# EAGLE design goodthopter10 (EAGLE 6.2)
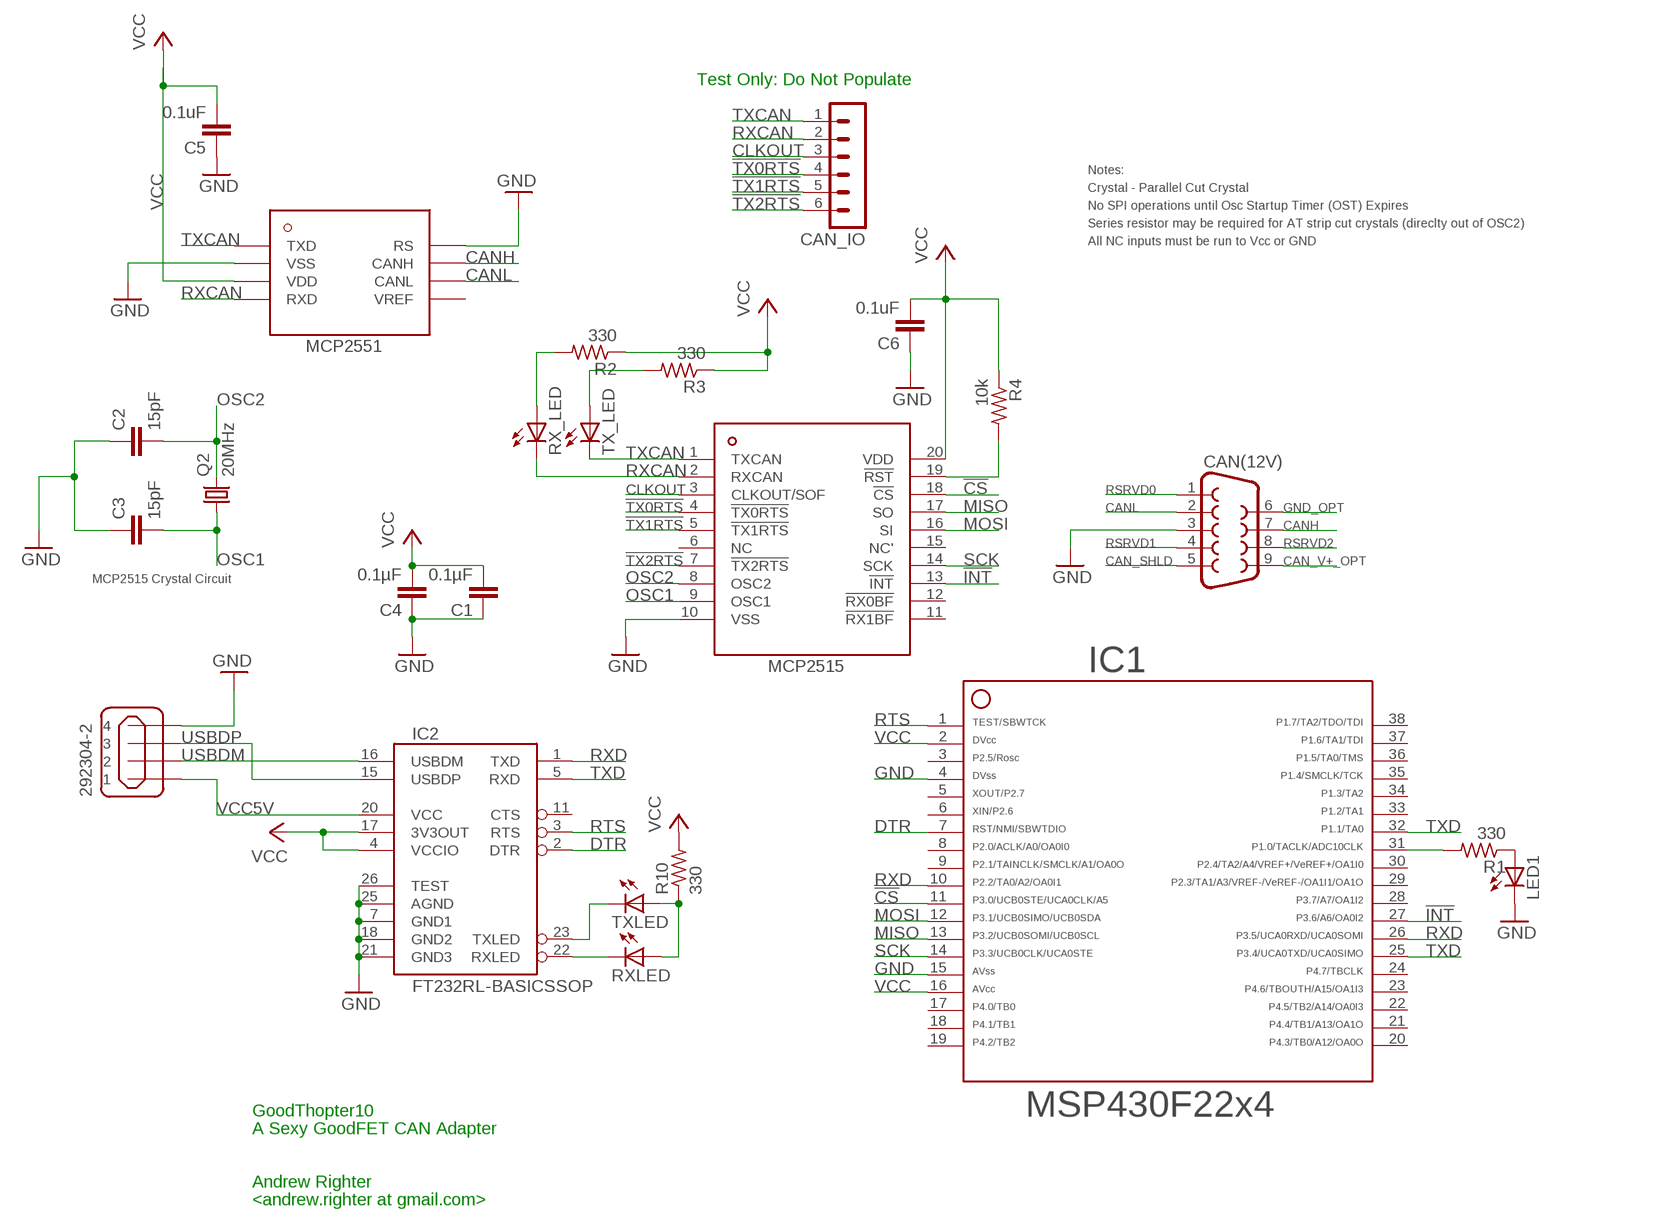
[diagram p0: schematic, sheet 1]

## Parts
292304-2  MINI-USB_4P-292304-2  [85-32004-10X]
C1  0.1µF  C-EUC0603  [C0603]
C2  15pF  C-EUC0603  [C0603]
C3  15pF  C-EUC0603  [C0603]
C4  0.1µF  C-EUC0603  [C0603]
C5  0.1uF  C-EUC0603  [C0603]
C6  0.1uF  C-EUC0603  [C0603]
CAN(12V)  DB9MALE  [DB9_MALE]
CAN_IO  MA06-1  [MA06-1]
IC1  F22X4---DA38  [DA38]
IC2  FT232RL-BASICSSOP  [SSOP28DB]
LED1  LEDCHIP-LED0603  [CHIP-LED0603]
Q2  20MHz  CRYSTALHC49UP  [HC49UP]
R1  330  R-US_R0603  [R0603]
R2  330  R-US_R0603  [R0603]
R3  330  R-US_R0603  [R0603]
R4  10k  R-US_R0603  [R0603]
R10  330  R-US_R0603  [R0603]
RX_LED  LEDCHIP-LED0603  [CHIP-LED0603]
RXLED  LEDCHIP-LED0603  [CHIP-LED0603]
TX_LED  LEDCHIP-LED0603  [CHIP-LED0603]
TXLED  LEDCHIP-LED0603  [CHIP-LED0603]
U$1  MCP2515  [TSSOP20]
U$2  MCP2551  [SOIC-8]

## Nets
!CS: IC1.11 U$1.18(!CS)
!INT: IC1.27 U$1.13(!INT)
!TX0RTS: CAN_IO.4 U$1.4(!TX0RTS)
!TX1RTS: CAN_IO.5 U$1.5(!TX1RTS)
!TX2RTS: CAN_IO.6 U$1.7(!TX2RTS)
CAN_SHLD: CAN(12V).5
CAN_V+_OPT: CAN(12V).9
CANH: CAN(12V).7 U$2.CANH
CANL: CAN(12V).2 U$2.CANL
CLKOUT: CAN_IO.3 U$1.3(CLKOUT/SOF)
DTR: IC1.7 IC2.2(DTR)
GND: 292304-2.4 C1.1 C2.1 C3.1 C4.1 C5.1 C6.1 CAN(12V).3 IC1.4 IC1.15 IC2.7(GND1) IC2.18(GND2) IC2.21(GND3) IC2.25(AGND) IC2.26(TEST) LED1.C U$1.10(VSS) U$2.RS U$2.VSS
GND_OPT: CAN(12V).6
MISO: IC1.13 U$1.17(SO)
MOSI: IC1.12 U$1.16(SI)
N$1: R2.2 RX_LED.A
N$2: R3.2 TX_LED.A
N$5: R4.2 U$1.19(!RST)
N$6: IC2.22(RXLED) RXLED.C
N$7: IC2.23(TXLED) TXLED.C
N$8: R10.1 RXLED.A TXLED.A
N$9: IC1.31 R1.2
N$10: LED1.A R1.1
OSC1: C3.2 Q2.1 U$1.9(OSC1)
OSC2: C2.2 Q2.2 U$1.8(OSC2)
RSRVD0: CAN(12V).1
RSRVD1: CAN(12V).4
RSRVD2: CAN(12V).8
RTS: IC1.1 IC2.3(RTS)
RXCAN: CAN_IO.2 RX_LED.C U$1.2(RXCAN) U$2.RXD
RXD: IC1.10 IC1.26 IC2.1(TXD)
SCK: IC1.14 U$1.14(SCK)
TXCAN: CAN_IO.1 TX_LED.C U$1.1(TXCAN) U$2.TXD
TXD: IC1.25 IC1.32 IC2.5(RXD)
USBDM: 292304-2.2 IC2.16(USBDM)
USBDP: 292304-2.3 IC2.15(USBDP)
VCC: C1.2 C4.2 C5.2 C6.2 IC1.2 IC1.16 IC2.4(VCCIO) IC2.17(3V3OUT) R2.1 R3.1 R4.1 R10.2 U$1.20(VDD) U$2.VDD
VCC5V: 292304-2.1 IC2.20(VCC)
Unconnected: IC1.3 IC1.5 IC1.6 IC1.8 IC1.9 IC1.17 IC1.18 IC1.19 IC1.20 IC1.21 IC1.22 IC1.23 IC1.24 IC1.28 IC1.29 IC1.30 IC1.33 IC1.34 IC1.35 IC1.36 IC1.37 IC1.38 IC2.11(CTS) U$1.6(NC) U$1.11(!RX1BF) U$1.12(!RX0BF) U$1.15(NC') U$2.VREF

## Notes on the sheet
- Test Only: Do Not Populate
- Notes:
- Crystal - Parallel Cut Crystal
- No SPI operations until Osc Startup Timer (OST) Expires
- Series resistor may be required for AT strip cut crystals (direclty out of OSC2)
- All NC inputs must be run to Vcc or GND
- MCP2515 Crystal Circuit
- 292304-2
- GoodThopter10
- A Sexy GoodFET CAN Adapter
- Andrew Righter
- <andrew.righter at gmail.com>

## Library data of the parts
292304-2 = USB-TYPE-B:MINI-USB_4P-: MINI USB 4 Pol. Source: www.cypressindustries.com; OC_FARNELL: unknown; OC_NEWARK: unknown
C1-C6 = rcl:C-EU: CAPACITOR, European symbol
CAN(12V) = SparkFun-Connectors:DB9: DB9 Connector Standard DB9 (D-Sub 9) serial connector. Can be used for CAN bus as well as RS485 and RS232. Footprint production proven. Spark Fun Electronics SKU : PRT-00429
CAN_IO = con-lstb:MA06-1: PIN HEADER; OC_FARNELL: unknown; OC_NEWARK: unknown
IC1 = TI_MSP430_v13:F22X4---DA38: ***MSP430F22x4***DA38
IC2 = SparkFun:FT232RL-BASIC: USB UART This is the simplified version of the FT232RL unit. Only what you need, nothing you don't. Spark Fun Electronics SKU : COM-00650
LED1 RX_LED RXLED TX_LED TXLED = led:LED: LED OSRAM: - CHIPLED LG R971, LG N971, LY N971, LG Q971, LY Q971, LO R971, LY R971 LH N974, LH R974 LS Q976, LO Q976, LY Q976 LO Q996 - Hyper CHIPLED LW Q18S LB Q993, LB Q99A, LB R99A - SideLED LS A670, LO A670, LY A670, LG A670, LP A670 LB A673, LV A673, LT A673, LW A673 LH A674 LY A675 LS A676, LA A676, LO A676, LY A676, LW A676 LS A679, LY A679, LG A679 - Hyper Micro SIDELED® LS Y876, LA Y876, LO Y876, LY Y876 LT Y87S - SmartLED LW L88C, LW L88S LB L89C, LB L89S, LG L890 LS L89K, LO L89K, LY L89K LS L896, LA L896, LO L896, LY L896 - TOPLED LS T670, LO T670, LY T670, LG T670, LP T670 LSG T670, LSP T670, LSY T670, LOP T670, LYG T670 LG T671, LOG T671, LSG T671 LB T673, LV T673, LT T673, LW T673 LH T674 LS T676, LA T676, LO T676, LY T676, LB T676, LH T676, LSB T676, LW T676 LB T67C, LV T67C, LT T67C, LS T67K, LO T67K, LY T67K, LW E67C LS E67B, LA E67B, LO E67B, LY E67B, LB E67C, LV E67C, LT E67C LW T67C LS T679, LY T679, LG T679 LS T770, LO T770, LY T770, LG T770, LP T770 LB T773, LV T773, LT T773, LW T773 LH T774 LS E675, LA E675, LY E675, LS T675 LS T776, LA T776, LO T776, LY T776, LB T776 LHGB T686 LT T68C, LB T68C - Hyper Mini TOPLED® LB M676 - Mini TOPLED Santana® LG M470 LS M47K, LO M47K, LY M47K Source: http://www.osram.convergy.de LUXEON: - LUMILED® LXK2-PW12-R00, LXK2-PW12-S00, LXK2-PW14-U00, LXK2-PW14-V00 LXK2-PM12-R00, LXK2-PM12-S00, LXK2-PM14-U00 LXK2-PE12-Q00, LXK2-PE12-R00, LXK2-PE12-S00, LXK2-PE14-T00, LXK2-PE14-U00 LXK2-PB12-K00, LXK2-PB12-L00, LXK2-PB12-M00, LXK2-PB14-N00, LXK2-PB14-P00, LXK2-PB14-Q00 LXK2-PR12-L00, LXK2-PR12-M00, LXK2-PR14-Q00, LXK2-PR14-R00 LXK2-PD12-Q00, LXK2-PD12-R00, LXK2-PD12-S00 LXK2-PH12-R00, LXK2-PH12-S00 LXK2-PL12-P00, LXK2-PL12-Q00, LXK2-PL12-R00 Source: www.luxeon.com KINGBRIGHT: KA-3528ASYC Source: www.kingbright.com
Q2 = crystal:CRYSTAL: CRYSTAL; OC_FARNELL: unknown; OC_NEWARK: unknown
R1-R4 R10 = rcl:R-US_: RESISTOR, American symbol
U$1 = MCP2515:MCP2515: Microchip Technology’s MCP2515 is a stand-alone Controller Area Network (CAN) controller that implements the CAN specification, version 2.0B. It is capable of transmitting and receiving both standard and extended data and remote frames. The MCP2515 has two acceptance masks and six acceptance filters that are used to filter out unwanted messages, thereby reducing the host MCUs overhead. The MCP2515 interfaces with microcontrollers (MCUs) via an industry standard Serial Peripheral Interface (SPI).
U$2 = MCP2551:MCP2551: The MCP2551 is a high-speed CAN, fault-tolerant device that serves as the interface between a CAN protocol controller and the physical bus. The MCP2551 provides differential transmit and receive capability for the CAN protocol controller and is fully compatible with the ISO-11898 standard, including 24V requirements. It will operate at speeds of up to 1 Mb/s. Typically, each node in a CAN system must have a device to convert the digital signals generated by a CAN controller to signals suitable for transmission over the bus cabling (differential output). It also provides a buffer between the CAN controller and the high-voltage spikes that can be generated on the CAN bus by outside sources (EMI, ESD, electrical transients, etc.).

## Board
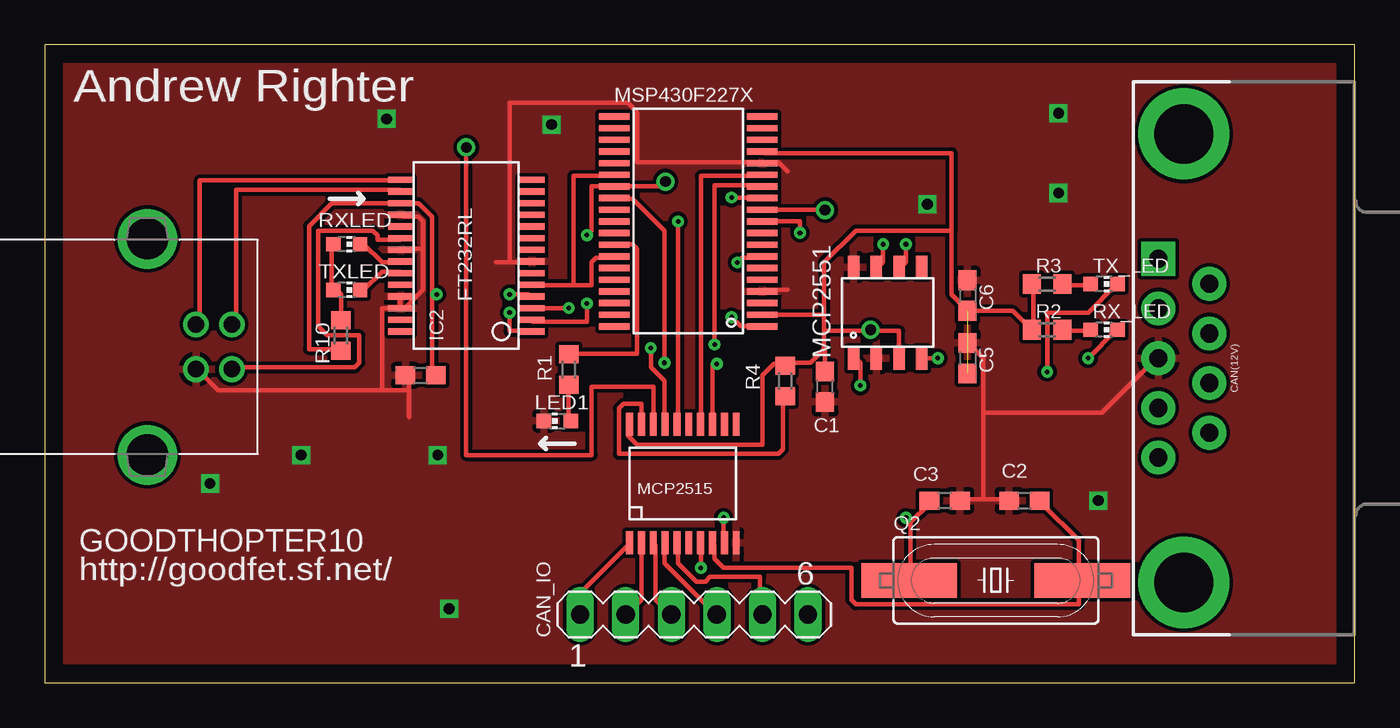
[diagram p1: board, top side]
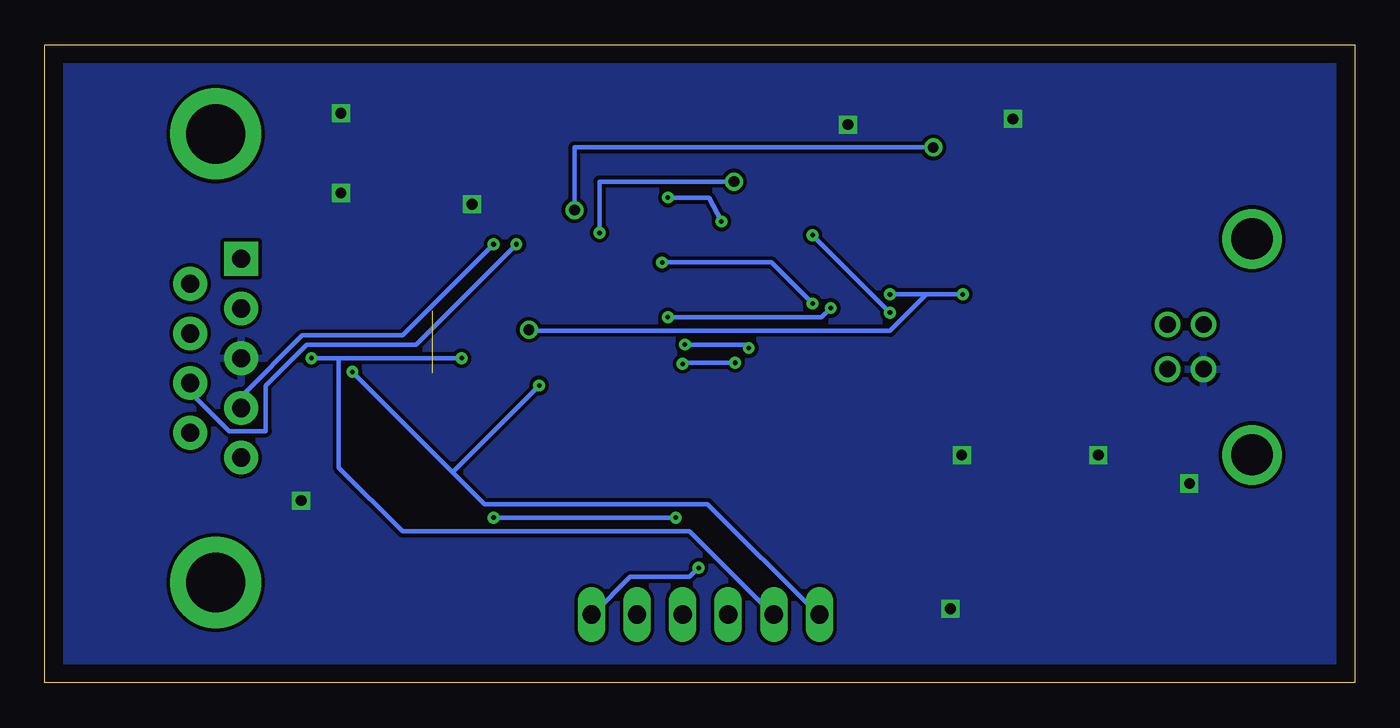
[diagram p2: board, bottom side, seen from below]

Size 73.03 x 35.56 mm. Coordinates in mm from the lower left corner, seen from the top.
Outline: 0,0 73.03,0 73.03,35.56 0,35.56 0,0
Copper layers (1*16): Top 0.035mm / dielectric 1.5mm / Bottom 0.035mm
Design rules: minimum track width 10mil, minimum drill 10mil, track to track 8mil, track to pad 8mil, pad to pad 8mil, via to via 8mil, smd to smd 8mil, copper to edge 40mil, drill to drill 10mil, minimum pad ring 10mil, minimum via ring 8mil, stop-mask expansion 4mil, vias tented up to drill 0mil, thermal gap 10mil

### Footprints (pad centres in the part's own frame; a part is rotated, then mirrored left to right if it is on the bottom)
85-32004-10X = drill 0.92 pad 1.27: 1 4.71,-1.25; 2 4.71,1.25; 3 2.71,1.25; 4 2.71,-1.25 | drill 2.3 pad 3: M1 0,6.02; M2 0,-6.02
C0603 = smd 1.1 x 1: 1 -0.85,0; 2 0.85,0
DB9_MALE = drill 1.016 pad 1.88: 1 5.54,-1.42; 2 2.77,-1.42; 3 0,-1.42; 4 -2.77,-1.42; 6 4.15,1.42; 7 1.38,1.42; 8 -1.38,1.42; 9 -4.15,1.42 | drill 1.016 pad 1.88 square: 5 -5.54,-1.42 | drill 3.302 pad 5.08: G1 -12.5,0; G2 12.5,0
MA06-1 = drill 1.016 long: 1 -6.35,0; 2 -3.81,0; 3 -1.27,0; 4 1.27,0; 5 3.81,0; 6 6.35,0
DA38 = smd 0.35 x 1.705: 1 -5.85,-4.12; 2 -5.2,-4.12; 3 -4.55,-4.12; 4 -3.9,-4.12; 5 -3.25,-4.12; 6 -2.6,-4.12; 7 -1.95,-4.12; 8 -1.3,-4.12; 9 -0.65,-4.12; 10 0,-4.12; 11 0.65,-4.12; 12 1.3,-4.12; 13 1.95,-4.12; 14 2.6,-4.12; 15 3.25,-4.12; 16 3.9,-4.12; 17 4.55,-4.12; 18 5.2,-4.12; 19 5.85,-4.12; 20 5.85,4.12; 21 5.2,4.12; 22 4.55,4.12; 23 3.9,4.12; 24 3.25,4.12; 25 2.6,4.12; 26 1.95,4.12; 27 1.3,4.12; 28 0.65,4.12; 29 0,4.12; 30 -0.65,4.12; 31 -1.3,4.12; 32 -1.95,4.12; 33 -2.6,4.12; 34 -3.25,4.12; 35 -3.9,4.12; 36 -4.55,4.12; 37 -5.2,4.12; 38 -5.85,4.12
SSOP28DB = smd 0.348 x 1.397: 1 -4.225,-3.656; 2 -3.575,-3.656; 3 -2.925,-3.656; 4 -2.275,-3.656; 5 -1.625,-3.656; 6 -0.975,-3.656; 7 -0.325,-3.656; 8 0.325,-3.656; 9 0.975,-3.656; 10 1.625,-3.656; 11 2.275,-3.656; 12 2.925,-3.656; 13 3.575,-3.656; 14 4.225,-3.656; 15 4.225,3.656; 16 3.575,3.656; 17 2.925,3.656; 18 2.275,3.656; 19 1.625,3.656; 20 0.975,3.656; 21 0.325,3.656; 22 -0.325,3.656; 23 -0.975,3.656; 24 -1.625,3.656; 25 -2.275,3.656; 26 -2.925,3.656; 27 -3.575,3.656; 28 -4.225,3.656
CHIP-LED0603 = smd 0.8 x 0.8: A 0,-0.75; C 0,0.75
HC49UP = smd 5.334 x 1.93: 1 -4.826,0; 2 4.826,0
R0603 = smd 1 x 1.1: 1 -0.85,0; 2 0.85,0
TSSOP20 = smd 1.27 x 0.381: 1 -3.302,2.642; 2 -3.302,1.981; 3 -3.302,1.321; 4 -3.302,0.66; 5 -3.302,0; 6 -3.302,-0.66; 7 -3.302,-1.321; 8 -3.302,-1.981; 9 -3.302,-2.642; 10 -3.302,-3.302; 11 3.302,-3.302; 12 3.302,-2.642; 13 3.302,-1.981; 14 3.302,-1.321; 15 3.302,-0.66; 16 3.302,0; 17 3.302,0.66; 18 3.302,1.321; 19 3.302,1.981; 20 3.302,2.642
SOIC-8 = smd 1.27 x 0.635: CANH 2.54,0.635; CANL 2.54,-0.635; RS 2.54,1.905; RXD -2.54,-1.905; TXD -2.54,1.905; VDD -2.54,-0.635; VREF 2.54,-1.905; VSS -2.54,0.635

### Placement (x,y rotation side)
292304-2  5.71,18.73 0 top
C1  43.5,16.51 90 top
C2  54.61,10.16 0 top
C3  50.16,10.16 180 top
C4  20.95,17.14 0 top
C5  51.44,18.1 270 top
C6  51.44,21.59 270 top
CAN(12V)  63.5,18.1 270 top
CAN_IO  36.2,3.81 0 top
IC1  35.88,25.72 90 top
IC2  23.5,23.81 90 top
LED1  28.57,14.61 90 top
Q2  53.02,5.71 0 top
R1  29.21,17.46 90 top
R2  55.88,19.68 0 top
R3  55.88,22.23 0 top
R4  41.27,16.83 270 top
R10  16.51,19.37 270 top
RX_LED  59.05,19.68 270 top
RXLED  16.83,24.45 270 top
TX_LED  59.05,22.23 270 top
TXLED  16.83,21.91 270 top
U$1  35.24,11.11 90 top
U$2  46.99,20.64 90 top

### Tracks (layer width: path | path; a pad name or v marks a point on that pad's centre or on a via)
!CS  (via drill 0.6)
  Top 0.254: IC1.11 43.48,26.37 v43.5,26.35 | v23.5,29.84 23.5,12.7 30.48,12.7 30.48,16.51 33.92,16.51 U$1.18
  Bottom 0.254: v43.5,26.35 43.5,29.84 v23.5,29.84
!INT  (via drill 0.25)
  Top 0.254: v34.54,17.84 34.54,25.21 32.77,26.99 32,26.99 IC1.27 | U$1.13 37.22,17.78 v37.47,17.78
  Bottom 0.254: v37.47,17.78 37.47,17.84 v34.54,17.84
!TX0RTS
  Top 0.254: U$1.4 34.54,7.68 34.54,6.67 37.34,3.87 CAN_IO.4
!TX1RTS
  Top 0.254: U$1.5 35.31,7.68 35.31,6.67 36.32,5.65 36.83,5.65 37.08,5.91 39.88,5.91 39.88,3.87 CAN_IO.5
!TX2RTS  (via drill 0.25)
  Top 0.254: v36.58,6.41 36.58,7.68 U$1.7
  Bottom 0.254: v36.58,6.41 37.08,5.91 40.39,5.91 42.42,3.87 CAN_IO.6
CANH  (via drill 0.25)
  Top 0.254: v46.74,24.45 46.74,23.43 46.48,23.18 U$2.CANH
  Bottom 0.254: v46.74,24.45 52.32,18.86 58.42,18.86 60.71,16.57 60.71,14.03 62.74,14.03 64.77,16.07 64.77,16.57 CAN(12V).7
CANL  (via drill 0.25)
  Top 0.254: v48.01,24.45 48.01,23.43 47.75,23.18 U$2.CANL
  Bottom 0.254: v48.01,24.45 53.09,19.37 58.67,19.37 61.98,16.07 61.98,15.56 CAN(12V).2
CLKOUT
  Top 0.254: U$1.3 34.04,7.68 34.04,4.64 34.8,3.87 CAN_IO.3
DTR  (via drill 0.25)
  Top 0.254: v30.23,21.14 30.23,20.13 27.18,20.13 IC2.2 | v38.61,23.43 38.86,23.69 39.88,23.69 IC1.7
  Bottom 0.254: v30.23,21.14 32.51,23.43 v38.61,23.43
GND  (via drill 0.6)
  Top 0.254: 52.32,10.22 53.59,10.22 C2.1 | 52.32,10.22 51.05,10.22 C3.1 | 52.32,10.22 52.32,15.05 | 52.32,15.05 52.32,18.1 51.56,18.86 C5.1 | 52.32,15.05 58.93,15.05 61.98,18.1 CAN(12V).3 | 41.4,21.91 40.13,21.91 IC1.4 | 41.4,28.51 40.89,29.02 40.13,29.02 IC1.15 39.88,29.02 33.02,29.02 33.02,31.81 32.51,32.32 25.91,32.32 25.91,23.43 | 19.81,20.89 19.81,21.4 IC2.25 | 21.08,24.19 20.07,24.19 IC2.21 | 21.08,24.19 21.08,21.91 20.07,20.89 IC2.26 19.81,20.89 | 21.08,24.19 21.08,25.72 20.83,25.97 20.07,25.97 IC2.18 | 20.32,16.32 20.32,17.08 C4.1 | 20.32,16.32 20.32,14.8 | 27.69,14.8 LED1.C | 25.15,23.43 25.91,23.43 | 25.91,23.43 26.92,23.43 IC2.7 | 20.32,16.32 18.8,16.32 | 18.8,16.32 9.65,16.32 8.64,17.34 292304-2.4 | 19.81,20.89 18.8,20.89 18.8,16.32
  other vias: 28.26,31.11 19.05,31.43 9.21,11.11 14.29,12.7 21.91,12.7 22.54,4.13 49.21,26.67 56.52,27.3 56.52,31.75 58.74,10.16
  pour Top: 0,35.56 73.03,35.56 73.03,0 0,0
  pour Bottom: 0,35.56 73.03,35.56 73.03,0 0,0
MISO  (via drill 0.25)
  Top 0.254: v33.78,18.67 33.78,17.59 34.54,16.83 34.54,14.54 U$1.17 | IC1.13 39.88,27.75 37.34,27.75 v37.34,18.86
  Bottom 0.254: v37.34,18.86 33.78,18.86 v33.78,18.67
MOSI  (via drill 0.25)
  Top 0.254: v35.31,25.72 35.31,14.54 U$1.16 | IC1.12 39.88,26.99 39.88,27.05 v38.29,27.05
  Bottom 0.254: v35.31,25.72 36.01,27.05 v38.29,27.05
N$1
  Top 0.254: RX_LED.A 58.17,19.62 56.9,19.62 R2.2
N$2
  Top 0.254: TX_LED.A 58.17,22.16 56.9,22.16 R3.2
N$5
  Top 0.254: U$1.19 33.27,14.54 33.27,15.56 32.26,15.56 32,15.3 32,12.76 40.89,12.76 41.15,13.02 41.15,15.85 R4.2
N$6
  Top 0.254: RXLED.C 17.78,24.45 18.8,23.43 19.81,23.43 IC2.22
N$7
  Top 0.254: TXLED.C 17.78,21.91 18.8,22.92 19.81,22.92 IC2.23
N$8
  Top 0.254: R10.1 16.51,21.65 16.26,21.91 TXLED.A 16,21.91 16,24.45 RXLED.A
N$9
  Top 0.254: R1.2 29.21,18.35 33.02,18.35 33.02,24.19 32.77,24.45 32,24.45 IC1.31
N$10
  Top 0.254: R1.1 29.21,14.8 LED1.A
OSC1  (via drill 0.25)
  Top 0.254: 48.26,8.95 49.28,9.97 C3.2 | 48.26,8.95 48.26,5.91 Q2.1 | v37.85,9.21 37.85,7.94 U$1.9 | 48.26,8.95 v48.01,9.21
  Bottom 0.254: v48.01,9.21 v37.85,9.21
OSC2
  Top 0.254: C2.2 55.63,9.97 57.66,7.94 57.66,5.91 Q2.2 57.66,5.65 57.66,4.38 45.21,4.38 44.96,4.64 44.96,6.41 37.85,6.41 37.34,6.92 37.34,7.68 U$1.8
RTS  (via drill 0.25)
  Top 0.254: v29.21,20.89 27.18,20.89 IC2.3 | IC1.1 39.88,19.88 38.8,19.88 v38.29,20.38
  Bottom 0.254: v29.21,20.89 29.72,20.38 v38.29,20.38
RXCAN  (via drill 0.25)
  Top 0.254: U$1.2 33.27,7.68 33.27,4.64 32.51,3.87 CAN_IO.2 | v58.17,18.1 59.69,19.62 RX_LED.C | U$2.RXD v49.78,18.1
  Bottom 0.254: v49.78,18.1 56.64,18.1 | 56.64,18.1 v58.17,18.1 | 56.64,18.1 56.64,12 53.09,8.45 37.08,8.45 32.51,3.87 CAN_IO.2
RXD  (via drill 0.25, 0.6)
  Top 0.254: v25.91,20.64 25.91,19.62 26.92,19.62 IC2.1 | v30.23,24.96 30.48,25.21 30.48,27.67 IC1.26 34.61,27.67 v34.61,27.94 | IC1.10 42.1,25.72 v42.1,25.08
  Bottom 0.254: v30.23,24.96 v25.91,20.64 | v34.61,27.94 42.1,27.94 v42.1,25.08
SCK
  Top 0.254: U$1.14 36.58,14.54 36.58,28.26 39.88,28.26 IC1.14
TXCAN  (via drill 0.25)
  Top 0.254: v55.88,17.34 55.88,20.64 58.17,20.64 59.69,22.16 TX_LED.C | U$1.1 32.51,7.68 29.97,5.14 29.97,3.87 CAN_IO.1 | v45.47,16.57 45.47,17.84 45.21,18.1 U$2.TXD
  Bottom 0.254: 50.29,11.75 48.51,9.97 36.07,9.97 29.97,3.87 CAN_IO.1 | 50.29,11.75 v55.88,17.34 | 50.29,11.75 v45.47,16.57
TXD
  Top 0.254: 29.46,22.16 30.48,22.16 30.48,23.43 30.73,23.69 31.75,23.69 IC1.32 | 29.46,22.16 27.18,22.16 IC2.5 | 29.46,22.16 29.46,28.26 31.75,28.26 IC1.25
USBDM
  Top 0.254: IC2.16 19.81,27.5 10.67,27.5 10.67,20.13 292304-2.2
USBDP
  Top 0.254: IC2.15 19.81,28 8.64,28 8.64,20.13 292304-2.3
VCC  (via drill 0.25, 0.6)  (1 unrouted)
  Top 0.254: U$1.20 32.51,14.29 32.51,13.78 33.02,13.27 40.01,13.27 40.01,17.14 40.64,17.78 41.17,17.78 R4.1 41.44,17.84 42.67,17.84 43.43,18.61 43.43,18.73 | IC1.16 40.13,29.53 50.55,29.53 50.55,25.21 | 54.86,22.42 R3.1 55.12,22.16 55.12,19.88 R2.1 53.98,20.74 C6.2 51.31,20.89 50.55,21.65 50.55,25.21 | 51.31,17.08 C5.2 | 47.75,18.1 U$2.VDD 47.62,19.62 46.04,19.62 | 21.59,21.65 21.59,25.97 20.83,26.73 20.07,26.73 IC2.17 19.81,26.73 16,26.73 14.73,25.46 14.73,18.61 16.51,18.61 R10.2 | 21.59,21.65 21.59,17.34 C4.2 | v25.91,21.65 26.92,21.65 IC2.4 | 21.59,21.65 v21.84,21.65 | 43.43,20.64 43.43,23.43 45.21,25.21 50.55,25.21 | 43.43,20.64 43.43,19.62 | 43.43,19.62 43.43,18.73 | IC1.2 43.31,20.52 43.43,20.64 | C1.2 43.5,18.67 43.43,18.73 | 46.04,19.62 43.43,19.62 | v46.04,19.68 46.04,19.62
  Bottom 0.254: v21.84,21.65 23.88,21.65 | 23.88,21.65 v25.91,21.65 | 23.88,21.65 25.91,19.62 45.97,19.62 arc90 v46.04,19.68
VCC5V
  Top 0.254: IC2.20 19.81,24.7 18.54,24.7 18.54,24.96 18.29,25.21 15.24,25.21 15.24,19.88 15.75,19.37 17.53,19.37 17.53,17.84 17.27,17.59 10.67,17.59 292304-2.1

### Text on the board
tPlace: GOODTHOPTER10
tNames: Andrew Righter | MSP430F227X | FT232RL | http://goodfet.sf.net/